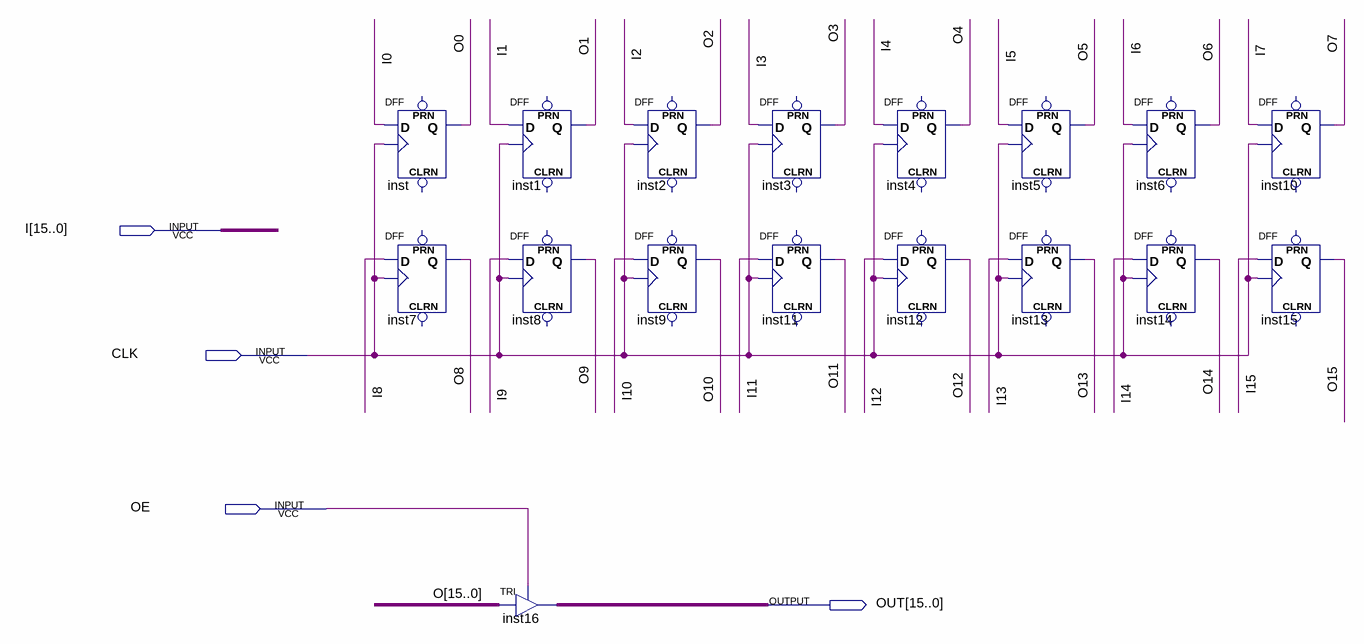
[diagram p0: schematic sheet]
// Quartus schematic REG16BIT.bdf as structural Verilog: 17 symbols, 4 pins
module REG16BIT (
  input  [15:0] I,
  input  CLK,
  input  OE,
  output [15:0] OUT
);

  wire [15:0] O;

  DFF inst (.CLK(CLK), .D(I[0]), .Q(O[0]));  // open: CLRN, PRN
  DFF inst7 (.CLK(CLK), .D(I[8]), .Q(O[8]));  // open: CLRN, PRN
  TRI inst16[15:0] (.IN(O), .OE(OE), .OUT(OUT));
  DFF inst1 (.CLK(CLK), .D(I[1]), .Q(O[1]));  // open: CLRN, PRN
  DFF inst8 (.CLK(CLK), .D(I[9]), .Q(O[9]));  // open: CLRN, PRN
  DFF inst2 (.CLK(CLK), .D(I[2]), .Q(O[2]));  // open: CLRN, PRN
  DFF inst9 (.CLK(CLK), .D(I[10]), .Q(O[10]));  // open: CLRN, PRN
  DFF inst3 (.CLK(CLK), .D(I[3]), .Q(O[3]));  // open: CLRN, PRN
  DFF inst11 (.CLK(CLK), .D(I[11]), .Q(O[11]));  // open: CLRN, PRN
  DFF inst4 (.CLK(CLK), .D(I[4]), .Q(O[4]));  // open: CLRN, PRN
  DFF inst12 (.CLK(CLK), .D(I[12]), .Q(O[12]));  // open: CLRN, PRN
  DFF inst5 (.CLK(CLK), .D(I[5]), .Q(O[5]));  // open: CLRN, PRN
  DFF inst13 (.CLK(CLK), .D(I[13]), .Q(O[13]));  // open: CLRN, PRN
  DFF inst6 (.CLK(CLK), .D(I[6]), .Q(O[6]));  // open: CLRN, PRN
  DFF inst14 (.CLK(CLK), .D(I[14]), .Q(O[14]));  // open: CLRN, PRN
  DFF inst10 (.CLK(CLK), .D(I[7]), .Q(O[7]));  // open: CLRN, PRN
  DFF inst15 (.CLK(CLK), .D(I[15]), .Q(O[15]));  // open: CLRN, PRN
endmodule
